# EAGLE design avrdds-3-5 (EAGLE 5.10)
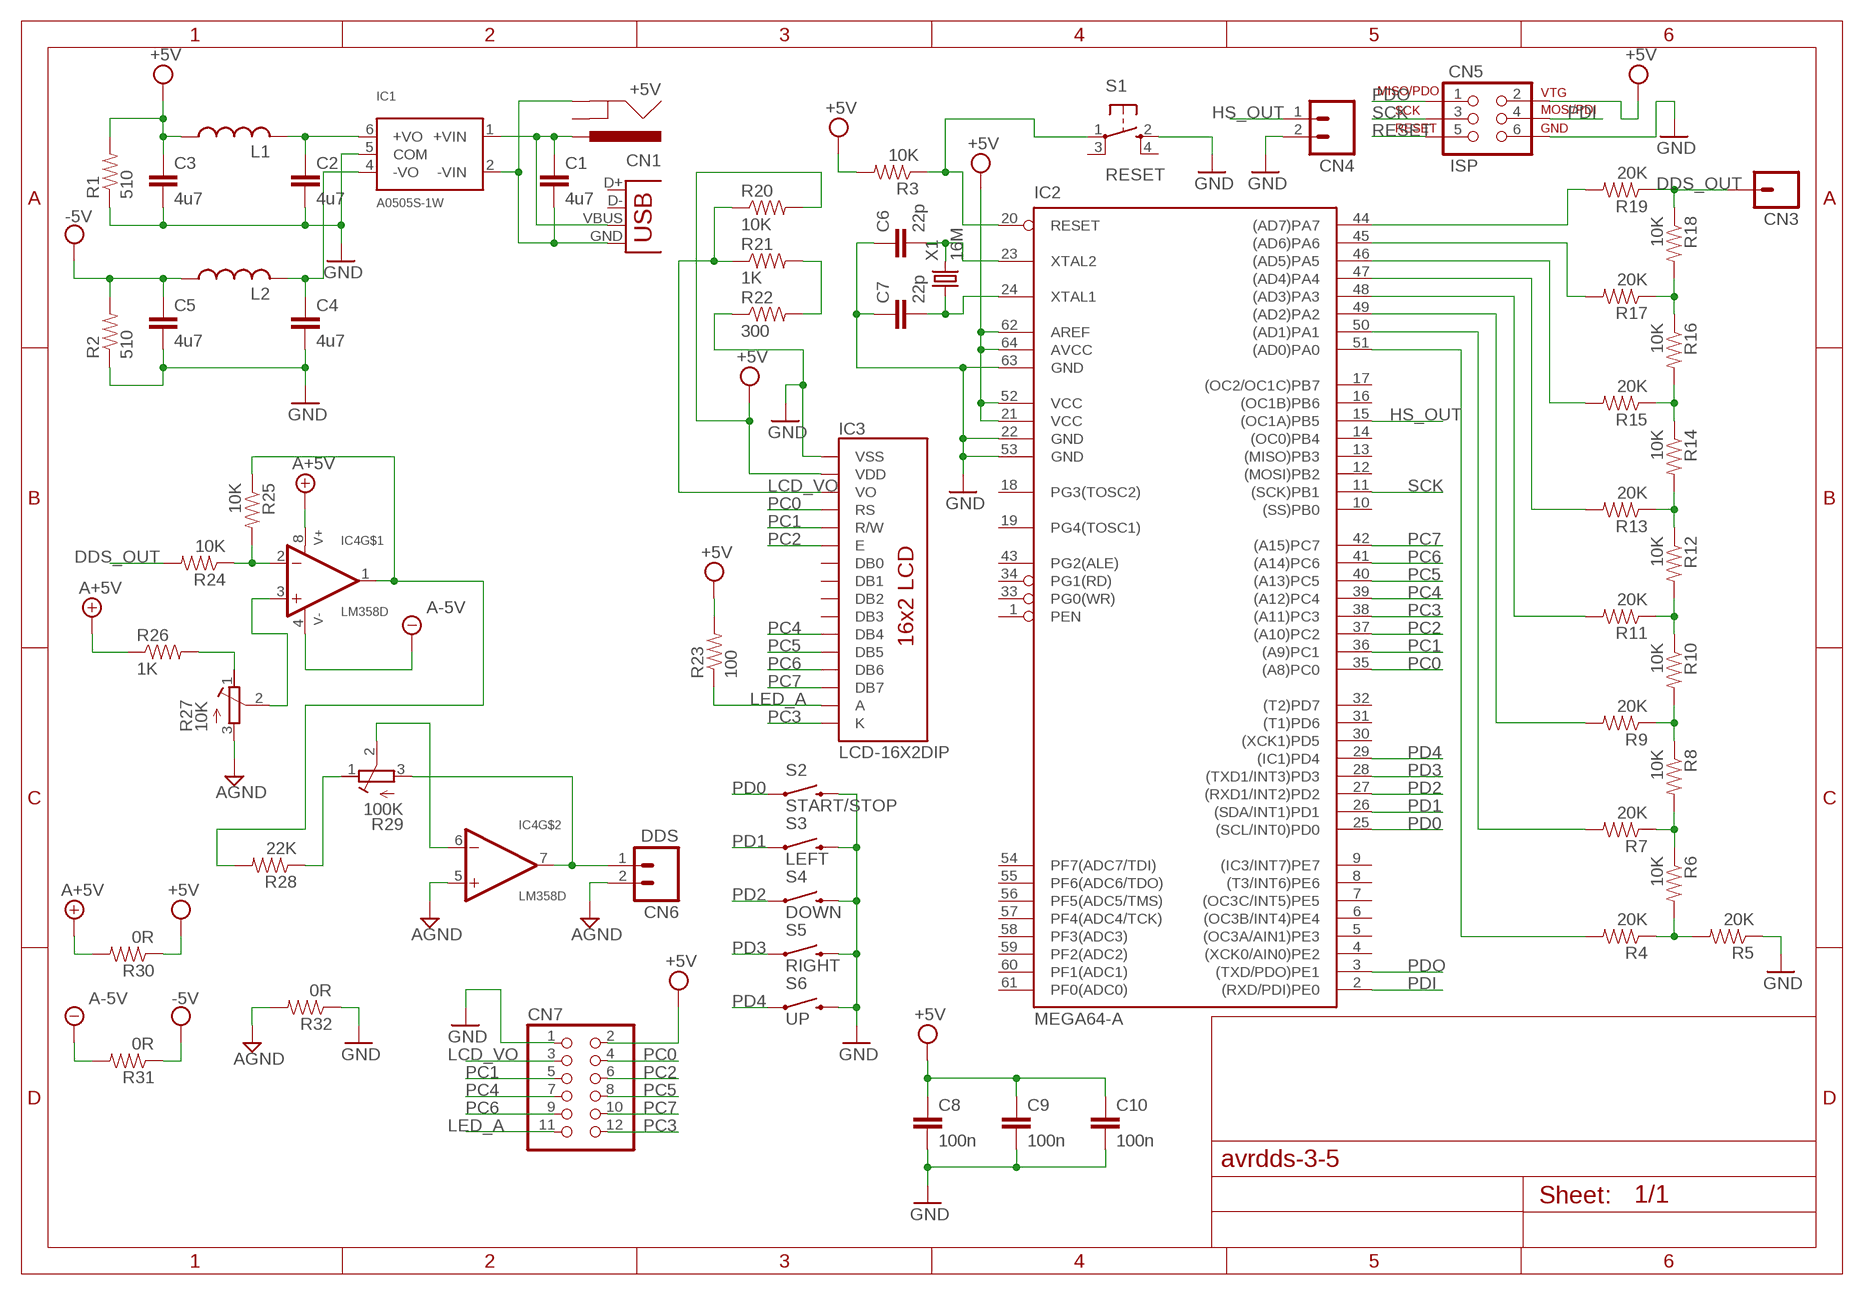
[diagram p0: schematic, sheet 1]

## Parts
C1  4u7  CAP0805  [0805]
C2  4u7  CAP0805  [0805]
C3  4u7  CAP0805  [0805]
C4  4u7  CAP0805  [0805]
C5  4u7  CAP0805  [0805]
C6  22p  CAP0805  [0805]
C7  22p  CAP0805  [0805]
C8  100n  CAP0805  [0805]
C9  100n  CAP0805  [0805]
C10  100n  CAP0805  [0805]
CN1  +5V  POWER_JACKPTH  [POWER_JACK_PTH]
CN2  USBSMD  [USB-MINIB]
CN3  M01PTH  [1X01]
CN4  M02PTH  [1X02]
CN5  ISP  AVR_SPI_PRG_6PTH  [2X3]
CN6  DDS  M02PTH  [1X02]
CN7  HEADER-2X6  [2X06]
IC1  A0505S-1W  [SIP-6]
IC2  MEGA64-A  [TQFP64]
IC3  LCD-16X2DIP  [LCD-16X2-A]
IC4  LM358D  LM358  [SOIC8]
L1  L-USL2012C  [L2012C]
L2  L-USL2012C  [L2012C]
R1  510  RESISTOR0805  [0805]
R2  510  RESISTOR0805  [0805]
R3  10K  RESISTOR0805  [0805]
R4  20K  RESISTOR0805  [0805]
R5  20K  RESISTOR0805  [0805]
R6  10K  RESISTOR0805  [0805]
R7  20K  RESISTOR0805  [0805]
R8  10K  RESISTOR0805  [0805]
R9  20K  RESISTOR0805  [0805]
R10  10K  RESISTOR0805  [0805]
R11  20K  RESISTOR0805  [0805]
R12  10K  RESISTOR0805  [0805]
R13  20K  RESISTOR0805  [0805]
R14  10K  RESISTOR0805  [0805]
R15  20K  RESISTOR0805  [0805]
R16  10K  RESISTOR0805  [0805]
R17  20K  RESISTOR0805  [0805]
R18  10K  RESISTOR0805  [0805]
R19  20K  RESISTOR0805  [0805]
R20  10K  RESISTOR0805  [0805]
R21  1K  RESISTOR0805  [0805]
R22  300  RESISTOR0805  [0805]
R23  100  RESISTOR0805  [0805]
R24  10K  RESISTOR0805  [0805]
R25  10K  RESISTOR0805  [0805]
R26  1K  RESISTOR0805  [0805]
R27  10K  R-TRIMMT93YA  [RTRIMT93YA]
R28  22K  RESISTOR0805  [0805]
R29  100K  R-TRIMMT93YA  [RTRIMT93YA]
R30  0R  RESISTOR0805  [0805]
R31  0R  RESISTOR0805  [0805]
R32  0R  RESISTOR0805  [0805]
S1  RESET  SWITCH-TACT_SFKHHM  [SWITCH-TACT_SFKHHM]
S2  START/STOP  SKHVBDD010  [SKHVBDD010]
S3  LEFT  SKHVBDD010  [SKHVBDD010]
S4  DOWN  SKHVBDD010  [SKHVBDD010]
S5  RIGHT  SKHVBDD010  [SKHVBDD010]
S6  UP  SKHVBDD010  [SKHVBDD010]
X1  16M  CRYSTALHC49US  [HC49US]

## Nets
+5V: C3.1 C8.1 C9.1 C10.1 CN5.2 CN7.2 IC2.21(VCC) IC2.52(VCC) IC2.62(AREF) IC2.64(AVCC) IC3.2(VDD) L1.1 R1.2 R3.2 R20.2 R23.2 R30.1
-5V: C5.1 L2.1 R2.2 R31.1
-VIN: C1.2 CN1.GND CN2.GND IC1.2(-VIN)
A+5V: IC4.8(V+) R26.1 R30.2
A-5V: IC4.4(V-) R31.2
AGND: CN6.2 IC4.5(+IN) R27.3(E) R32.2
DDS: CN6.1 IC4.7(OUT) R29.3(E)
DDS_OUT: CN3.1 R18.1 R19.1 R24.2
GND: C2.2 C3.2 C4.2 C5.2 C6.1 C7.1 C8.2 C9.2 C10.2 CN4.2 CN5.6 CN7.1 IC1.5(COM) IC2.22(GND) IC2.53(GND) IC2.63(GND) IC3.1(VSS) R1.1 R2.1 R5.1 R22.1 R32.1 S1.2 S2.2 S3.2 S4.2 S5.2 S6.2
HS_OUT: CN4.1 IC2.15((OC1A)PB5)
LCD_VO: CN7.3 IC3.3(VO) R20.1 R21.1
LED_A: CN7.11 IC3.16(A) R23.1
N$1: C6.2 IC2.23(XTAL2) X1.2
N$2: C1.1 CN1.PWR CN2.VBUS IC1.1(+VIN)
N$3: C2.1 IC1.6(+VO) L1.2
N$4: C7.2 IC2.24(XTAL1) X1.1
N$5: R4.1 R5.2 R6.2
N$6: C4.1 IC1.4(-VO) L2.2
N$8: IC2.51((AD0)PA0) R4.2
N$9: R6.1 R7.1 R8.2
N$10: IC2.50((AD1)PA1) R7.2
N$11: R8.1 R9.1 R10.2
N$12: IC2.49((AD2)PA2) R9.2
N$13: R10.1 R11.1 R12.2
N$14: IC2.48((AD3)PA3) R11.2
N$15: R12.1 R13.1 R14.2
N$16: IC2.47((AD4)PA4) R13.2
N$17: R14.1 R15.1 R16.2
N$18: IC2.46((AD5)PA5) R15.2
N$19: R16.1 R17.1 R18.2
N$20: IC2.45((AD6)PA6) R17.2
N$21: R21.2 R22.2
N$22: IC2.44((AD7)PA7) R19.2
N$23: IC4.2(-IN) R24.1 R25.2
N$25: IC4.1(OUT) R25.1 R28.2
N$26: R28.1 R29.1(A)
N$27: R26.2 R27.1(A)
N$28: IC4.3(+IN) R27.2(S)
N$30: IC4.6(-IN) R29.2(S)
PC0: CN7.4 IC2.35((A8)PC0) IC3.4(RS)
PC1: CN7.5 IC2.36((A9)PC1) IC3.5(R/W)
PC2: CN7.6 IC2.37((A10)PC2) IC3.6(E)
PC3: CN7.12 IC2.38((A11)PC3) IC3.17(K)
PC4: CN7.7 IC2.39((A12)PC4) IC3.11(DB4)
PC5: CN7.8 IC2.40((A13)PC5) IC3.12(DB5)
PC6: CN7.9 IC2.41((A14)PC6) IC3.13(DB6)
PC7: CN7.10 IC2.42((A15)PC7) IC3.14(DB7)
PD0: IC2.25((SCL/INT0)PD0) S2.1
PD1: IC2.26((SDA/INT1)PD1) S3.1
PD2: IC2.27((RXD1/INT2)PD2) S4.1
PD3: IC2.28((TXD1/INT3)PD3) S5.1
PD4: IC2.29((IC1)PD4) S6.1
PDI: CN5.4 IC2.2((RXD/PDI)PE0)
PDO: CN5.1 IC2.3((TXD/PDO)PE1)
RESET: CN5.5 IC2.20(RESET) R3.1 S1.1
SCK: CN5.3 IC2.11((SCK)PB1)
Unconnected: CN1.GNDBREAK CN2.D+ CN2.D- IC2.1(PEN) IC2.4((XCK0/AIN0)PE2) IC2.5((OC3A/AIN1)PE3) IC2.6((OC3B/INT4)PE4) IC2.7((OC3C/INT5)PE5) IC2.8((T3/INT6)PE6) IC2.9((IC3/INT7)PE7) IC2.10((SS)PB0) IC2.12((MOSI)PB2) IC2.13((MISO)PB3) IC2.14((OC0)PB4) IC2.16((OC1B)PB6) IC2.17((OC2/OC1C)PB7) IC2.18(PG3(TOSC2)) IC2.19(PG4(TOSC1)) IC2.30((XCK1)PD5) IC2.31((T1)PD6) IC2.32((T2)PD7) IC2.33(PG0(WR)) IC2.34(PG1(RD)) IC2.43(PG2(ALE)) IC2.54(PF7(ADC7/TDI)) IC2.55(PF6(ADC6/TDO)) IC2.56(PF5(ADC5/TMS)) IC2.57(PF4(ADC4/TCK)) IC2.58(PF3(ADC3)) IC2.59(PF2(ADC2)) IC2.60(PF1(ADC1)) IC2.61(PF0(ADC0)) IC3.7(DB0) IC3.8(DB1) IC3.9(DB2) IC3.10(DB3) S1.3 S1.4

## Library data of the parts
C1-C10 = avrdds2014:CAP: Capacitor Standard 0603 ceramic capacitor, and 0.1" leaded capacitor.
CN1 = avrdds2014:POWER_JACK: Power Jack This is the standard 5.5mm barrel jack for power. The PTH is the most common, proven, reliable, footprint. All others are experimental. The Slot footprint only works if the mill layer is transmitted to the PCB fab house so be warned. Spark Fun Electronics SKU : PRT-00119. Mating wall wart : TOL-00298 (and others)
CN2 = avrdds2014:USB: USB Connectors USB-B-PTH is fully proven SKU : PRT-00139 USB-miniB is fully proven SKU : PRT-00587 USB-A-PCB is untested. USB-A-H is throughly reviewed, but untested. Spark Fun Electronics SKU : PRT-00437 USB-B-SMT is throughly reviewed, but untested. Needs silkscreen touching up. USB-A-S has not been used/tested USB-MB-H has not been used/tested
CN3 = avrdds2014:M01: Header 1 Standard 1-pin 0.1" header. Use with straight break away headers (SKU : PRT-00116), right angle break away headers (PRT-00553), swiss pins (PRT-00743), machine pins (PRT-00117), and female headers (PRT-00115).
CN4 CN6 = avrdds2014:M02: Header 2 Standard 2-pin 0.1" header. Use with straight break away headers (SKU : PRT-00116), right angle break away headers (PRT-00553), swiss pins (PRT-00743), machine pins (PRT-00117), and female headers (PRT-00115). Molex polarized connector foot print use with SKU : PRT-08233 with associated crimp pins and housings.
CN5 = avrdds2014:AVR_SPI_PRG_6: AVR ISP 6 Pin This is the reduced ISP connector for AVR programming. Common on Arduino. This footprint will take up less PCB space and can be used with a 10-pin to 6-pin adapter such as SKU: BOB-08508
CN7 = avrdds2014:HEADER-2X6: PIN HEADER
IC1 = avrdds2014:A0505S-1W
IC2 = avrdds2014:MEGA64: MICROCONTROLLER 64 Kbytes FLASH 4 Kbytes SRAM 2 Kbytes EEPROM DUAL USART 8-channel 10 bit ADC Source: avr.lbr
IC3 = avrdds2014:LCD-16X2
IC4 = avrdds2014:LM358: LM358 Dual Operational Amplifier Digikey: LM358AMXFSCT-ND
L1 L2 = avrdds2014:L-US: INDUCTOR, American symbol
R1-R26 R28 R30-R32 = avrdds2014:RESISTOR: Resistor Basic schematic elements and footprints for 0402, 0603, 0805, 1206, PTH 1/10th watt (small), 0102, 0204, and etc. resistors.
R27 R29 = avrdds2014:R-TRIMM: Trimm resistor
S1 = avrdds2014:SWITCH-TACT_SFKHHM: Tact Switch made by Forward, Taiwan. Model No. Prefix SFKHHM
S2-S6 = avrdds2014:SKHVBDD010: ALPS SWITCH 6mm(L)x6mm(W)x4.3 mm(H) Operating Force: 0.98 N Travel: 0.25 mm Switch Function: OFF - (ON) Termination Style: Through Hole Contact Current Rating: 50 mA @ 12 Volts
X1 = avrdds2014:CRYSTAL: Crystals Various standard crystals. Proven footprints. Spark Fun Electronics SKU : COM-00534

## Board
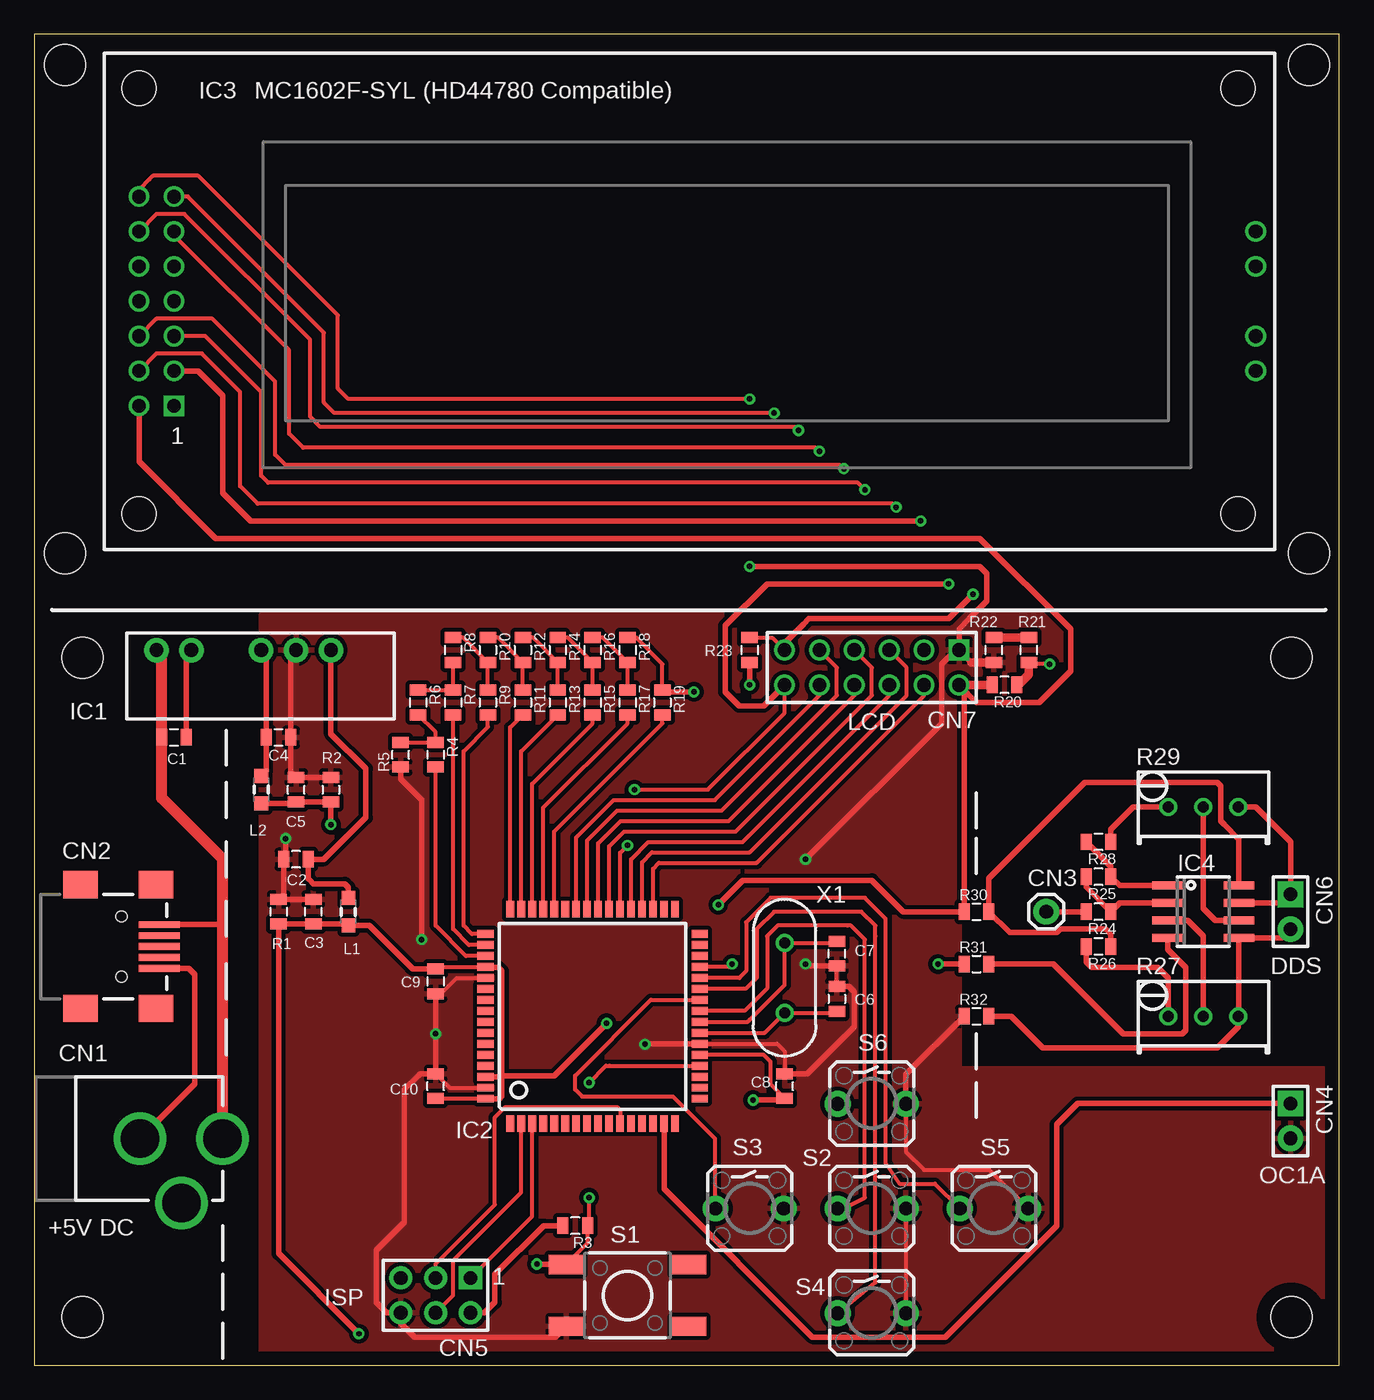
[diagram p1: board, top side]
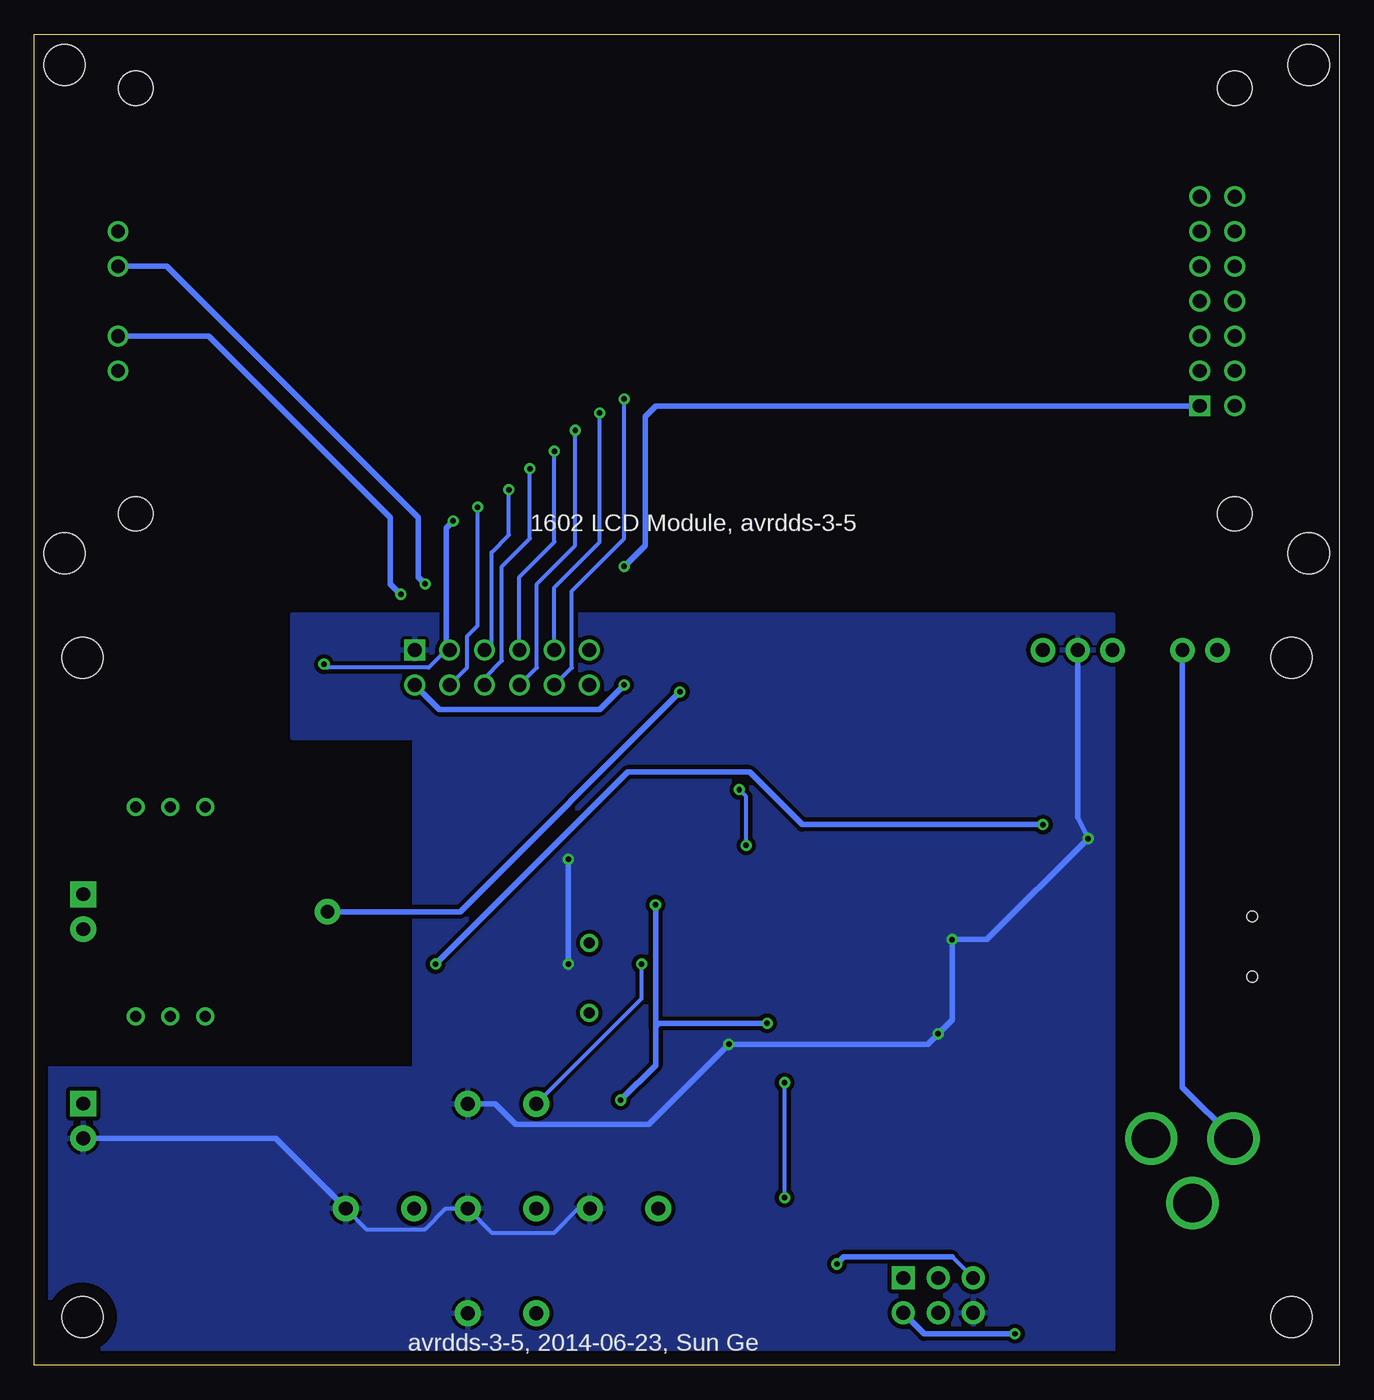
[diagram p2: board, bottom side, seen from below]

Size 95 x 96.91 mm. Coordinates in mm from the lower left corner, seen from the top.
Outline: 0,0 95,0 95,96.91 0,96.91 0,0
Copper layers (1*16): Top 0.035mm / dielectric 1.5mm / Bottom 0.035mm
Design rules "8mils *": minimum track width 8mil, minimum drill 0.4mm, track to track 8mil, track to pad 8mil, pad to pad 8mil, via to via 8mil, smd to smd 8mil, copper to edge 40mil, drill to drill 10mil, minimum pad ring 10mil, minimum via ring 8mil, stop-mask expansion 0mil, vias tented up to drill 16mil, thermal gap 10mil
Holes 3 mm at 3.5,3.5 91.5,3.5 91.5,51.5 3.5,51.5 2.23,94.68 2.23,59.12 92.8,59.12 92.8,94.68

### Footprints (pad centres in the part's own frame; a part is rotated, then mirrored left to right if it is on the bottom)
0805 = smd 0.8 x 1.2: 1 -0.9,0; 2 0.9,0
POWER_JACK_PTH = drill 2.8 round: GND 7.7,0; GNDBREAK 10.7,-4.7; PWR 13.7,0
USB-MINIB = smd 3 x 0.5: D+ 2.75,0; D- 2.75,0.8; GND 2.75,-1.6; ID 2.75,-0.8; VBUS 2.75,1.6 | smd 2.5 x 2: GND@1 -3,-4.5; GND@2 -3,4.5; GND@3 2.5,4.5; GND@4 2.5,-4.5 | hole 0.8: 0,2.2; 0,-2.2
1X01 = drill 1 pad 1.88 round: 1 0,0
1X02 = drill 1 pad 1.88 square: 1 0,0 | drill 1 pad 1.88 round: 2 2.54,0
2X3 = drill 1 pad 1.676 square: 1 0,0 | drill 1 pad 1.676 round: 2 0,2.54; 3 2.54,0; 4 2.54,2.54; 5 5.08,0; 6 5.08,2.54
2X06 = drill 1 square: 1 -7.62,-1.27 | drill 1 round: 2 -7.62,1.27; 3 -5.08,-1.27; 4 -5.08,1.27; 5 -2.54,-1.27; 6 -2.54,1.27; 7 0,-1.27; 8 0,1.27; 9 2.54,-1.27; 10 2.54,1.27; 11 5.08,-1.27; 12 5.08,1.27
SIP-6 = drill 1 pad 1.778 round: 1 -7.62,0; 2 -5.08,0; 4 0,0; 5 2.54,0; 6 5.08,0
TQFP64 = smd 1.194 x 0.559: 1 -7.8,6; 2 -7.8,5.2; 3 -7.8,4.4; 4 -7.8,3.6; 5 -7.8,2.8; 6 -7.8,2; 7 -7.8,1.2; 8 -7.8,0.4; 9 -7.8,-0.4; 10 -7.8,-1.2; 11 -7.8,-2; 12 -7.8,-2.8; 13 -7.8,-3.6; 14 -7.8,-4.4; 15 -7.8,-5.2; 16 -7.8,-6; 33 7.8,-6; 34 7.8,-5.2; 35 7.8,-4.4; 36 7.8,-3.6; 37 7.8,-2.8; 38 7.8,-2; 39 7.8,-1.2; 40 7.8,-0.4; 41 7.8,0.4; 42 7.8,1.2; 43 7.8,2; 44 7.8,2.8; 45 7.8,3.6; 46 7.8,4.4; 47 7.8,5.2; 48 7.8,6 | smd 0.559 x 1.194: 17 -6,-7.8; 18 -5.2,-7.8; 19 -4.4,-7.8; 20 -3.6,-7.8; 21 -2.8,-7.8; 22 -2,-7.8; 23 -1.2,-7.8; 24 -0.4,-7.8; 25 0.4,-7.8; 26 1.2,-7.8; 27 2,-7.8; 28 2.8,-7.8; 29 3.6,-7.8; 30 4.4,-7.8; 31 5.2,-7.8; 32 6,-7.8; 49 6,7.8; 50 5.2,7.8; 51 4.4,7.8; 52 3.6,7.8; 53 2.8,7.8; 54 2,7.8; 55 1.2,7.8; 56 0.4,7.8; 57 -0.4,7.8; 58 -1.2,7.8; 59 -2,7.8; 60 -2.8,7.8; 61 -3.6,7.8; 62 -4.4,7.8; 63 -5.2,7.8; 64 -6,7.8
LCD-16X2-A = drill 1 square: 1 5.084,10.166 | drill 1 round: 2 2.544,10.166; 3 5.084,12.706; 4 2.544,12.706; 5 5.084,15.246; 6 2.544,15.246; 7 5.084,17.786; 8 2.544,17.786; 9 5.084,20.326; 10 2.544,20.326; 11 5.084,22.866; 12 2.544,22.866; 13 5.084,25.406; 14 2.544,25.406; 15 83.824,12.706; 16 83.824,15.246; 17 83.824,20.326; 18 83.824,22.866 | hole 2.5: 2.54,33.3; 2.54,2.3; 82.54,33.3; 82.54,2.3
SOIC8 = smd 0.6 x 2.2: 1 -1.905,-2.6; 2 -0.635,-2.6; 3 0.635,-2.6; 4 1.905,-2.6; 5 1.905,2.6; 6 0.635,2.6; 7 -0.635,2.6; 8 -1.905,2.6
L2012C = smd 1 x 1: 1 -1,0; 2 1,0
RTRIMT93YA = drill 0.8 round: 1 0,-2.54; 2 0,0; 3 0,2.54
SWITCH-TACT_SFKHHM = smd 2.5 x 1.4: 1 -4.475,2.25; 2 -4.475,-2.25; 3 4.475,2.25; 4 4.475,-2.25
SKHVBDD010 = drill 1 pad 1.88 round: 1 -2.489,-0.025; 2 2.489,-0.025
HC49US = drill 0.8 round: 1 -2.54,0; 2 2.54,0

### Placement (x,y rotation side)
C1  10.16,45.72 0 top
C2  19.05,36.83 180 top
C3  20.32,33.02 90 top
C4  17.78,45.72 0 top
C5  19.05,41.91 90 top
C6  58.42,26.67 270 top
C7  58.42,29.97 90 top
C8  54.61,20.32 90 top
C9  29.21,27.94 270 top
C10  29.21,20.32 90 top
CN1  0,16.51 0 top
CN2  6.35,30.48 0 top
CN3  73.66,33.02 0 top
CN4  91.44,19.05 270 top
CN5  31.75,6.35 180 top
CN6  91.44,34.29 270 top
CN7  59.69,50.8 180 top
IC1  16.51,52.07 0 top
IC2  40.64,25.4 90 top
IC3  5.08,59.69 0 top
IC4  85.09,33.02 270 top
L1  22.86,33.02 90 top
L2  16.51,41.91 90 top
R1  17.78,33.02 270 top
R2  21.59,41.91 270 top
R3  39.37,10.16 180 top
R4  29.21,44.45 270 top
R5  26.67,44.45 90 top
R6  27.94,48.26 270 top
R7  30.48,48.26 270 top
R8  30.48,52.07 270 top
R9  33.02,48.26 270 top
R10  33.02,52.07 270 top
R11  35.56,48.26 270 top
R12  35.56,52.07 270 top
R13  38.1,48.26 270 top
R14  38.1,52.07 270 top
R15  40.64,48.26 270 top
R16  40.64,52.07 270 top
R17  43.18,48.26 270 top
R18  43.18,52.07 270 top
R19  45.72,48.26 270 top
R20  70.61,49.53 180 top
R21  72.39,52.07 90 top
R22  69.85,52.07 90 top
R23  52.07,52.07 270 top
R24  77.47,33.02 180 top
R25  77.47,35.56 180 top
R26  77.47,30.48 180 top
R27  85.09,25.4 270 top
R28  77.47,38.1 180 top
R29  85.09,40.64 270 top
R30  68.58,33.02 0 top
R31  68.58,29.21 0 top
R32  68.58,25.4 0 top
S1  43.18,5.08 0 top
S2  60.96,11.43 0 top
S3  52.07,11.43 0 top
S4  60.96,3.81 0 top
S5  69.85,11.43 0 top
S6  60.96,19.05 0 top
X1  54.61,28.19 270 top

### Tracks (layer width: path | path; a pad name or v marks a point on that pad's centre or on a via)
+5V  (via drill 0.4)
  Top 0.305: IC2.52 29.37,29 C9.1 | IC2.64 29.23,19.4 C10.1 | IC2.21 53.09,22.6 53.59,22.1 53.59,20.44 C8.1
  Top 0.406: C9.1 27.55,28.84 27.43,28.96 24.37,32.02 L1.1 22.76,32.12 C3.1 R1.2 17.78,8.13 v23.62,2.29 | IC2.64 33.88,19.4 34.04,19.56 34.04,21.08 | 34.04,21.08 34.04,28.7 33.78,28.96 32.88,28.96 IC2.52 | IC2.62 33.95,21 34.04,21.08 | R3.2 37.08,10.16 33.53,6.6 33.53,4.57 32.77,3.81 CN5.2 | v49.78,33.53 51.56,35.31 60.96,35.31 63.25,33.02 R30.1 67.68,49.16 CN7.2 68.58,48.26 69.85,48.26 73.15,48.26 75.44,50.55 75.44,53.59 68.83,60.2 13.21,60.2 7.62,65.78 IC3.2 | v52.32,19.3 54.49,19.3 C8.1 | 34.04,21.08 37.85,21.08 v41.66,24.89 | v52.07,49.53 R23.2 | R20.2 69.85,49.39
  Top 0.61: CN7.2 R20.2
  Bottom 0.406: v23.62,2.29 30.23,2.29 CN5.2 | 49.78,24.64 49.78,21.84 v52.32,19.3 | 49.78,24.64 v49.78,33.53 | v41.66,24.89 49.53,24.89 49.78,24.64 | v52.07,49.53 53.85,47.75 65.53,47.75 CN7.2
-5V  (via drill 0.4)
  Top 0.406: L2.1 18.95,40.91 C5.1 R2.2 v21.59,39.37 | v65.79,29.21 R31.1
  Bottom 0.406: v21.59,39.37 39.12,39.37 42.93,43.18 51.82,43.18 58.93,36.07 v65.79,29.21
-VIN
  Top 0.406: CN2.GND 11.25,28.88 11.68,28.45 11.68,20.49 CN1.GND | C1.2 11.06,51.7 IC1.2
  Bottom 0.406: IC1.2 11.43,20.24 CN1.GND
A+5V
  Top 0.406: R26.1 78.37,31.36 77.98,31.75 74.68,31.75 74.42,31.5 71,31.5 R30.2 69.48,35.44 75.95,41.91 76.45,42.42 86.11,42.42 86.36,42.16 86.36,39.62 86.61,39.37 87.69,38.29 IC4.8
A-5V
  Top 0.406: IC4.4 82.49,30.29 83.82,28.96 83.82,24.38 83.57,24.13 79.25,24.13 74.17,29.21 R31.2
AGND
  Top 0.406: CN6.2 90.81,31.11 IC4.5 87.69,25.46 R27.3 87.63,24.64 86.11,23.11 73.41,23.11 71.12,25.4 R32.2
DDS
  Top 0.406: IC4.7 90.81,33.66 CN6.1 91.44,38.1 88.9,40.64 R29.3
DDS_OUT  (via drill 0.4)
  Top 0.305: R18.1 43.8,52.97 45.72,51.05 R19.1
  Top 0.406: CN3.1 R24.2 | v48.01,49.02 45.86,49.02 R19.1
  Bottom 0.406: CN3.1 64.01,33.02 v48.01,49.02
GND  (via drill 0.4)
  Top 0.305: C6.1 C7.1 | IC2.53 30.74,28.2 29.72,27.18 29.58,27.04 C9.2 | IC2.63 30.23,20.2 C10.2 | IC2.22 54.07,23.4 54.61,22.86 C8.2 | S6.2 63.45,15.54 64.77,14.22 69.52,14.22 S5.2 | S2.2 S4.2
  Top 0.406: IC1.5 18.68,51.7 C4.2 18.68,43.18 C5.2 R2.1 | C3.2 R1.1 18.15,34.29 C2.2 18.29,36.97 v18.29,38.35 | IC2.22 44.48,23.4 v44.45,23.37 | C9.2 v29.21,24.13 C10.2 28.08,21.22 27.94,21.08 26.92,20.07 26.92,10.41 24.89,8.38 24.89,4.57 25.65,3.81 CN5.6 26.67,3.05 27.69,2.03 37.91,2.03 S1.2 | S6.2 63.45,21.17 R32.1 | R5.1 26.67,42.67 28.19,41.15 v28.19,30.99 | C6.1 59.3,27.57 59.69,27.18 59.69,24.64 56.39,21.34 56.27,21.22 C8.2 | CN7.1 67.06,52.07 66.04,51.05 66.04,46.74 v56.13,36.83 | C7.1 56.27,29.07 v56.13,29.21 | CN7.1 68.21,51.17 | v52.07,58.17 66.04,58.17 68.58,58.17 68.83,58.17 69.34,57.66 69.34,55.63 68.07,54.36 67.31,53.59 CN7.1
  Top 0.61: 68.21,51.17 R22.1
  Bottom 0.305: S3.2 55.4,11.4 57.15,9.65 61.7,9.65 S2.2 65.05,11.4 66.55,9.91 70.84,9.91 S5.2
  Bottom 0.406: CN4.2 77.44,16.51 S5.2 | S6.2 61.44,19.02 59.94,17.53 50.29,17.53 v44.45,23.37 29.97,23.37 v29.21,24.13 28.19,25.15 v28.19,30.99 25.65,30.99 v18.29,38.35 19.05,39.88 IC1.5 | v56.13,29.21 v56.13,36.83 | IC3.1 49.78,69.86 50.55,69.09 50.55,59.69 v52.07,58.17
  pour Top (isolate 0.305): 16.51,54.61 16.51,0 95.25,0 95.25,21.59 67.31,21.59 67.31,45.72 76.2,45.72 76.2,54.61
  pour Bottom (isolate 0.305): 16.51,54.61 16.51,0 95.25,0 95.25,21.59 67.31,21.59 67.31,45.72 76.2,45.72 76.2,54.61
HS_OUT
  Top 0.406: IC2.15 45.84,12.83 56.64,2.03 66.29,2.03 74.42,10.16 74.42,17.53 75.95,19.05 CN4.1
LCD_VO  (via drill 0.4)
  Top 0.305: v73.91,51.05 72.51,51.05 R21.1
  Top 0.406: IC3.3 11.93,72.4 13.72,70.61 13.72,63.5 15.75,61.47 v64.52,61.47
  Top 0.61: R20.1 71.63,49.53 72.39,50.29 R21.1
  Bottom 0.305: 65.02,52.07 65.28,51.82 66.29,50.8 73.66,50.8 v73.91,51.05
  Bottom 0.406: v64.52,61.47 65.02,60.96 65.02,52.07 CN7.3
LED_A  (via drill 0.4)
  Top 0.305: R23.1 53.71,52.97 CN7.11
  Top 0.406: CN7.11 54.61,52.58 56.01,53.98 | 56.01,53.98 56.39,54.36 | v68.33,56.13 66.55,54.36 56.39,54.36 | 56.01,53.98 56.39,54.36
  Bottom 0.406: v68.33,56.13 69.09,56.9 69.09,61.72 82.3,74.94 IC3.16
N$1
  Top 0.305: IC2.23 53.16,24.2 X1.2 58.3,25.65 C6.2
N$2
  Top 0.406: CN2.VBUS 13.37,32.08 13.7,31.75
  Top 0.813: CN1.PWR 13.7,31.75 13.7,36.85 9.26,41.29 C1.1 9.26,51.7 IC1.1
N$3
  Top 0.406: IC1.6 21.59,45.97 24.13,43.43 24.13,39.88 21.08,36.83 C2.1 19.95,35.42 20.07,35.31 20.32,35.05 22.61,35.05 22.86,34.8 L1.2
N$4
  Top 0.305: IC2.24 51.92,25 52.07,25.15 54.61,27.69 X1.1 58.28,30.73 C7.2
N$5
  Top 0.305: R6.2 29.21,46.09 R4.1 R5.2
N$6
  Top 0.406: IC1.4 16.88,51.7 C4.1 16.88,43.28 L2.2
N$8
  Top 0.305: IC2.51 31.41,29.8 29.21,32 R4.2
N$9
  Top 0.305: R6.1 R7.1 R8.2
N$10
  Top 0.305: IC2.50 31.63,30.6 30.48,31.75 30.48,42.67 R7.2
N$11
  Top 0.305: R9.1 R10.2 31.22,52.97 R8.1
N$12
  Top 0.305: IC2.49 31.85,31.4 31.24,32 31.24,44.7 33.02,46.48 R9.2
N$13
  Top 0.305: R11.1 R12.2 33.76,52.97 R10.1
N$14
  Top 0.305: IC2.48 34.64,46.44 R11.2
N$15
  Top 0.305: R13.1 R14.2 36.3,52.97 R12.1
N$16
  Top 0.305: IC2.47 35.44,44.7 R13.2
N$17
  Top 0.305: R15.1 R16.2 38.84,52.97 R14.1
N$18
  Top 0.305: IC2.46 36.24,42.34 40.64,46.74 R15.2
N$19
  Top 0.305: R17.1 R18.2 41.38,52.97 R16.1
N$20
  Top 0.305: IC2.45 37.04,40.6 43.18,46.74 R17.2
N$21
  Top 0.61: R22.2 R21.2
N$22
  Top 0.305: IC2.44 37.84,38.86 45.72,46.74 R19.2
N$23
  Top 0.406: IC4.2 79,33.66 R24.1 76.57,34.82 R25.2
N$25
  Top 0.406: IC4.1 79,34.92 R25.1 78.37,36.3 R28.2
N$26
  Top 0.406: R28.1 78.37,39 80.01,40.64 R29.1
N$27
  Top 0.406: R27.1 82.55,28.19 81.79,28.96 76.96,28.96 76.71,29.21 76.57,29.35 R26.2
N$28
  Top 0.406: IC4.3 83.95,32.38 84.33,32 85.09,31.24 R27.2
N$30
  Top 0.406: IC4.6 85.98,32.38 85.09,33.27 R29.2
PC0  (via drill 0.4)
  Top 0.305: IC2.35 45.04,36.15 45.47,36.58 52.58,36.58 64.77,48.77 CN7.4 | IC3.4 8.89,73.66 12.19,73.66 14.99,70.87 14.99,64.01 16.26,62.74 62.48,62.74 v62.74,62.48
  Bottom 0.305: v62.74,62.48 62.74,53.85 63.5,53.09 63.5,50.8 CN7.4
PC1  (via drill 0.4)
  Top 0.305: IC2.36 44.24,36.62 44.96,37.34 52.07,37.34 63.5,48.77 63.5,50.8 CN7.5 | IC3.5 12.44,74.94 16.51,70.87 16.51,64.77 17.02,64.26 59.94,64.26 v60.45,63.75
  Bottom 0.305: v60.45,63.75 60.45,60.45 61.72,59.18 61.72,52.58 CN7.5
PC2  (via drill 0.4)
  Top 0.305: IC2.37 43.44,36.84 44.7,38.1 51.56,38.1 62.23,48.77 CN7.6 | IC3.6 8.89,76.2 12.95,76.2 17.53,71.63 17.53,66.29 18.29,65.53 58.67,65.53 v58.93,65.28
  Bottom 0.305: v58.93,65.28 58.93,60.2 60.71,58.42 60.96,58.17 60.96,51.31 62.23,50.04 CN7.6
PC3  (via drill 0.4)
  Top 0.305: IC2.38 42.64,37.31 v43.18,37.85 | v43.69,41.91 49.02,41.91 54.61,47.5 CN7.12
  Top 0.406: v66.55,56.9 53.34,56.9 50.29,53.85 50.29,49.02 51.31,48.01 53.09,48.01 CN7.12
  Bottom 0.305: v43.18,37.85 43.18,41.4 v43.69,41.91
  Bottom 0.406: v66.55,56.9 67.06,57.4 67.06,61.72 85.35,80.02 IC3.17
PC4  (via drill 0.4)
  Top 0.305: IC2.39 41.84,37.78 42.93,38.86 51.05,38.86 60.96,48.77 60.96,50.8 CN7.7 | IC3.11 10.16,82.29 18.54,73.91 18.54,67.82 19.56,66.8 56.9,66.8 v57.15,66.55
  Bottom 0.305: v57.15,66.55 57.15,59.94 59.69,57.4 CN7.7
PC5  (via drill 0.4)
  Top 0.305: IC2.40 41.04,37.99 42.67,39.62 50.55,39.62 59.69,48.77 CN7.8 | IC3.12 8.89,83.82 10.92,83.82 20.07,74.68 20.07,69.09 20.83,68.33 55.37,68.33 v55.63,68.07
  Bottom 0.305: v55.63,68.07 55.63,59.69 58.42,56.9 58.42,50.8 CN7.8
PC6  (via drill 0.4)
  Top 0.305: IC2.41 40.24,38.21 42.42,40.39 50.04,40.39 58.42,48.77 58.42,50.8 CN7.9 | IC3.13 11.17,85.1 21.08,75.18 21.08,70.1 21.84,69.34 v53.85,69.34
  Bottom 0.305: v53.85,69.34 53.85,59.94 57.15,56.64 CN7.9
PC7  (via drill 0.4)
  Top 0.305: IC2.42 39.44,38.42 42.16,41.15 49.53,41.15 57.15,48.77 CN7.10 | IC3.14 7.62,85.6 8.38,86.36 8.64,86.61 11.94,86.61 21.84,76.71 22.1,76.45 22.1,71.12 22.86,70.36 v52.07,70.36
  Bottom 0.305: v52.07,70.36 52.07,60.2 55.88,56.39 55.88,50.8 CN7.10
PD0
  Top 0.305: IC2.25 51.71,25.8 53.34,27.43 53.34,31.24 54.1,32 59.18,32 59.44,32 60.45,30.99 60.45,12.19 58.9,11.4 S2.1
PD1
  Top 0.305: IC2.26 44.89,26.6 39.37,21.08 39.37,20.07 39.88,19.56 46.48,19.56 49.53,16.51 49.53,11.46 S3.1
PD2
  Top 0.305: IC2.27 51.78,27.4 52.58,28.19 52.58,31.75 53.85,33.02 59.44,33.02 60.2,33.02 61.21,32 61.21,31.24 61.21,6.02 S4.1
PD3
  Top 0.305: IC2.28 51.31,28.2 51.82,28.7 51.82,32.26 53.59,34.04 59.94,34.04 60.45,34.04 61.98,32.51 61.98,14.73 62.99,13.21 65.56,13.21 S5.1
PD4  (via drill 0.4)
  Top 0.305: IC2.29 50.59,29 v50.8,29.21
  Bottom 0.305: v50.8,29.21 50.8,26.7 S6.1
PDI
  Top 0.305: IC2.2 35.44,12.58 30.48,7.62 30.48,5.08 CN5.4
PDO
  Top 0.305: IC2.3 36.24,10.84 CN5.1
RESET  (via drill 0.4)
  Top 0.305: IC2.20 41.87,21.8 41.61,21.8 v40.39,20.57 | v40.39,12.19 40.39,10.28 R3.1 40.27,8.89 S1.1
  Top 0.406: S1.1 36.61,7.33 v36.58,7.37
  Bottom 0.305: v40.39,12.19 v40.39,20.57 | CN5.5 28.19,7.87
  Bottom 0.406: 28.19,7.87 36.07,7.87 v36.58,7.37
SCK
  Top 0.305: IC2.11 42.64,18.57 42.42,18.8 34.29,18.8 33.53,18.03 33.53,11.68 29.21,7.37 CN5.3

### Text on the board
tPlace: MC1602F-SYL (HD44780 Compatible) | LCD | DDS | OC1A | +5V DC | ISP
bPlace: 1602 LCD Module, avrdds-3-5 | avrdds-3-5, 2014-06-23, Sun Ge